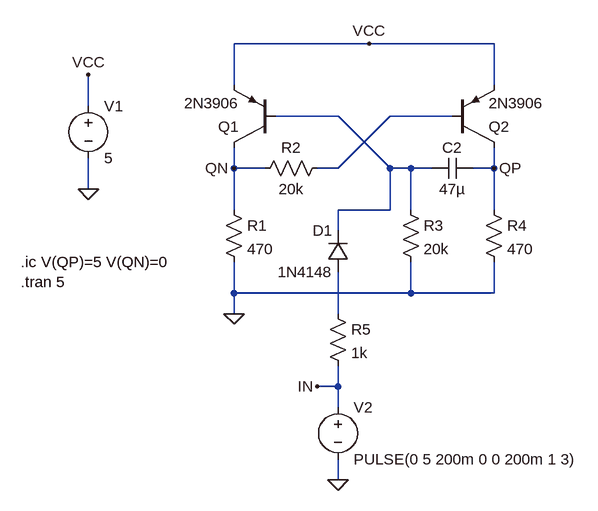
[diagram p0: schematic monostable_pnp.asc]
monostable_pnp.asc, the LTspice schematic file:
Version 4
SHEET 1 880 740
WIRE 240 48 32 48
WIRE 432 48 240 48
WIRE 32 112 32 48
WIRE 432 112 432 48
WIRE -192 144 -192 96
WIRE 192 160 96 160
WIRE 368 160 272 160
WIRE 32 240 32 208
WIRE 80 240 32 240
WIRE 192 240 272 160
WIRE 192 240 160 240
WIRE 272 240 192 160
WIRE 304 240 272 240
WIRE 336 240 304 240
WIRE 432 240 432 208
WIRE 432 240 400 240
WIRE -192 272 -192 224
WIRE 32 304 32 240
WIRE 272 304 272 240
WIRE 272 304 192 304
WIRE 304 304 304 240
WIRE 432 304 432 240
WIRE 192 336 192 304
WIRE 32 432 32 384
WIRE 304 432 304 384
WIRE 304 432 32 432
WIRE 432 432 432 384
WIRE 432 432 304 432
WIRE 32 464 32 432
WIRE 192 464 192 400
WIRE 192 576 192 544
WIRE 192 576 160 576
WIRE 192 608 192 576
WIRE 192 720 192 688
FLAG 32 464 0
FLAG 240 48 VCC
FLAG 32 240 QN
FLAG 432 240 QP
FLAG -192 272 0
FLAG -192 96 VCC
FLAG 192 720 0
FLAG 160 576 IN
SYMBOL res 16 288 R0
SYMATTR InstName R1
SYMATTR Value 470
SYMBOL res 176 224 R90
WINDOW 0 0 56 VBottom 2
WINDOW 3 32 56 VTop 2
SYMATTR InstName R2
SYMATTR Value 20k
SYMBOL res 288 288 R0
SYMATTR InstName R3
SYMATTR Value 20k
SYMBOL res 416 288 R0
SYMATTR InstName R4
SYMATTR Value 470
SYMBOL cap 400 224 R90
WINDOW 0 0 32 VBottom 2
WINDOW 3 32 32 VTop 2
SYMATTR InstName C2
SYMATTR Value 47µ
SYMBOL voltage -192 128 R0
WINDOW 123 0 0 Left 0
WINDOW 39 0 0 Left 0
SYMATTR InstName V1
SYMATTR Value 5
SYMBOL pnp 96 208 R180
SYMATTR InstName Q1
SYMATTR Value 2N3906
SYMBOL pnp 368 208 M180
SYMATTR InstName Q2
SYMATTR Value 2N3906
SYMBOL diode 208 400 R180
WINDOW 0 24 64 Left 2
WINDOW 3 24 0 Left 2
SYMATTR InstName D1
SYMATTR Value 1N4148
SYMBOL res 176 448 R0
SYMATTR InstName R5
SYMATTR Value 1k
SYMBOL voltage 192 592 R0
WINDOW 123 0 0 Left 0
WINDOW 39 0 0 Left 0
SYMATTR InstName V2
SYMATTR Value PULSE(0 5 200m 0 0 200m 1 3)
TEXT -296 384 Left 2 !.ic V(QP)=5 V(QN)=0\n.tran 5

The netlist it stands for:
* monostable_pnp.asc
R1 QN 0 470
R2 N002 QN 20k
R3 N001 0 20k
R4 QP 0 470
C2 QP N001 47µ
V1 VCC 0 5
Q1 QN N001 VCC 0 2N3906
Q2 QP N002 VCC 0 2N3906
D1 N003 N001 1N4148
R5 N003 IN 1k
V2 IN 0 PULSE(0 5 200m 0 0 200m 1 3)
.model D D
.lib standard.dio
.model NPN NPN
.model PNP PNP
.lib standard.bjt
.ic V(QP)=5 V(QN)=0
.tran 5
.backanno
.end